# EAGLE design handheld temp sensor (EAGLE 7.2.0)
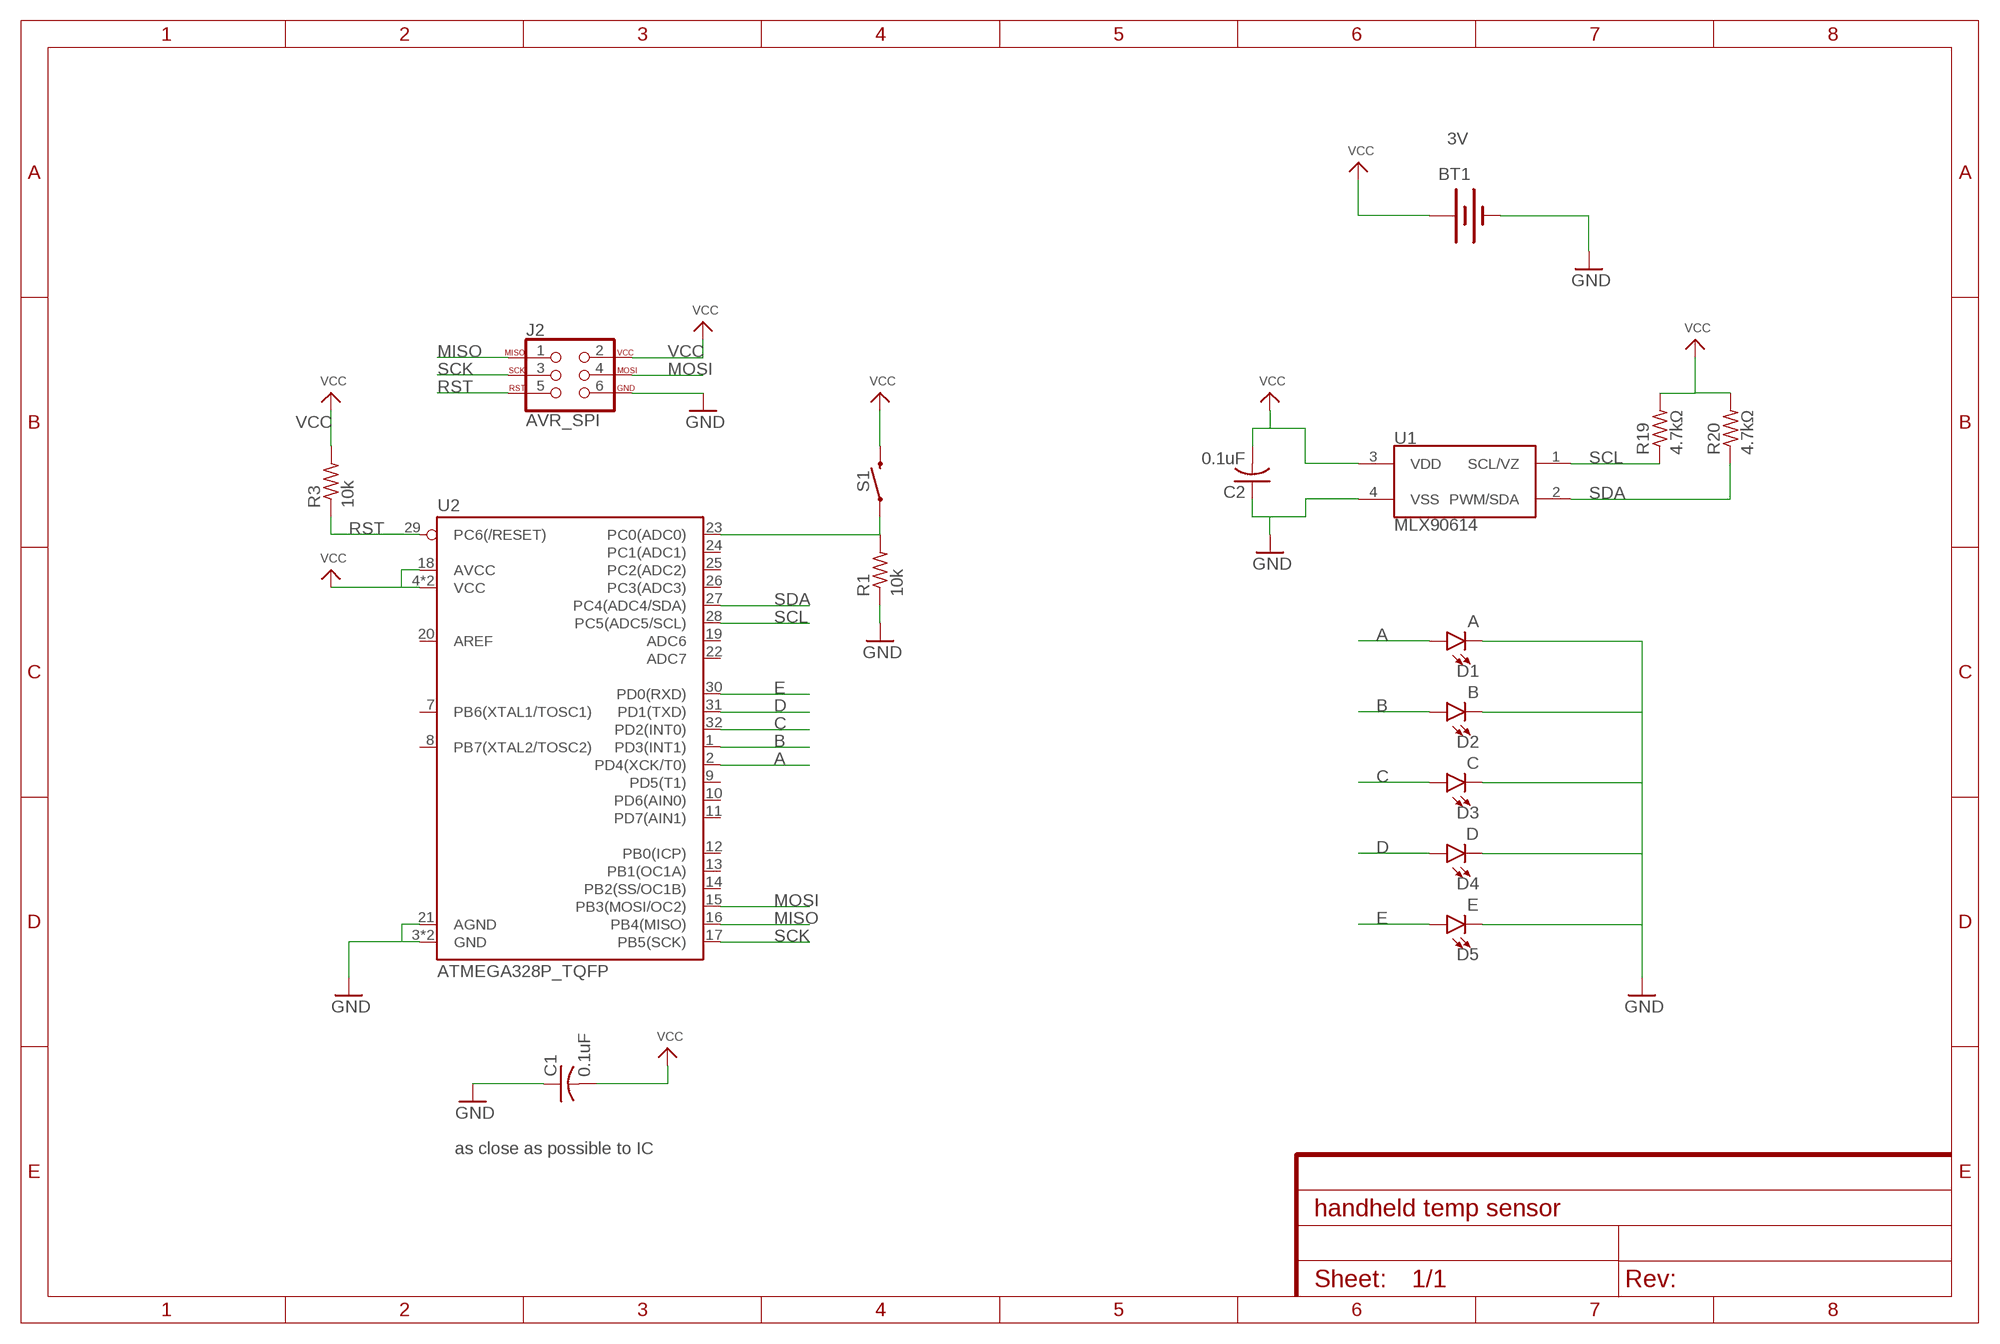
[diagram p0: schematic, sheet 1]

## Parts
BT1  BATTERYFOB  [BATTERY_20MM_PTH_COMPACT]
C1  0.1uF  C-USC1206  [C1206]
C2  0.1uF  C-USC1206  [C1206]
D1  A  LED-RED1206  [LED-1206]
D2  B  LED-RED1206  [LED-1206]
D3  C  LED-RED1206  [LED-1206]
D4  D  LED-RED1206  [LED-1206]
D5  E  LED-RED1206  [LED-1206]
J2  AVR_SPI  AVR_SPI_PROG_3X2SMD  [2X3_SMT_POSTS]
R1  10k  R-US_R1206  [R1206]
R3  10k  R-US_R1206  [R1206]
R19  4.7kΩ  R-US_R1206  [R1206]
R20  4.7kΩ  R-US_R1206  [R1206]
S1  MOMENTARY-SWITCH-SPST-PTH-6.0MM  [TACTILE_SWITCH_PTH_6.0MM]
U1  MLX90614  [TO-39]
U2  ATMEGA328P_TQFP  [TQFP32-08]

## Nets
A: D1.A U2.2(PD4(XCK/T0))
B: D2.A U2.1(PD3(INT1))
C: D3.A U2.32(PD2(INT0))
D: D4.A U2.31(PD1(TXD))
E: D5.A U2.30(PD0(RXD))
GND: BT1.2(-) C1.1 C2.1 D1.C D2.C D3.C D4.C D5.C J2.6 R1.1 U1.4(VSS) U2.3(GND) U2.5(GND) U2.21(AGND)
MISO: J2.1 U2.16(PB4(MISO))
MOSI: J2.4 U2.15(PB3(MOSI/OC2))
N$1: R1.2 S1.1 U2.23(PC0(ADC0))
RST: J2.5 R3.1 U2.29(PC6(/RESET))
SCK: J2.3 U2.17(PB5(SCK))
SCL: R19.1 U1.1(SCL/VZ) U2.28(PC5(ADC5/SCL))
SDA: R20.1 U1.2(PWM/SDA) U2.27(PC4(ADC4/SDA))
VCC: C1.2 J2.2 R3.2 U2.4(VCC) U2.6(VCC) U2.18(AVCC)
VMOTOR: BT1.1(+) C2.2 R19.2 R20.2 S1.3 U1.3(VDD) ; supply symbol labelled VCC
Unconnected: U2.7(PB6(XTAL1/TOSC1)) U2.8(PB7(XTAL2/TOSC2)) U2.9(PD5(T1)) U2.10(PD6(AIN0)) U2.11(PD7(AIN1)) U2.12(PB0(ICP)) U2.13(PB1(OC1A)) U2.14(PB2(SS/OC1B)) U2.19(ADC6) U2.20(AREF) U2.22(ADC7) U2.24(PC1(ADC1)) U2.25(PC2(ADC2)) U2.26(PC3(ADC3))

## Notes on the sheet
- 3V
- as close as possible to IC

## Library data of the parts
BT1 = SparkFun-Retired:BATTERY: Battery - Single Cell A variety of battery chemistries, sizes, and footprints. Including AA, AAA, 18650 (PRT-12895), 20mm coin cell and 12mm coin cell. 20MM_4LEGS, BATT-10373
C1 C2 = adafruit:C-US: CAPACITOR, American symbol
D1-D5 = SparkFun-LED:LED-RED: Red SMD LED Used in manufacturing of most products at SparkFun Packages: 0603 - SMD 0603 package [Product Link] <http://docs.avagotech.com/docs/AV02-0551EN> 0603 SMART - SMD 0603 SMART package ( more efficient and expensive)[Product Link] <http://www.osram-os.com/Graphics/XPic2/00077099_0.pdf> 1206 - SMD1206 package [Product Link] <https://www.sparkfun.com/datasheets/DevTools/LilyPad/Q150OVS4.pdff> SparkFun Products: Pro Mini 328 -5V <https://www.sparkfun.com/products/821> RedBoard <https://www.sparkfun.com/products/12757> IOIO-OTG <https://www.sparkfun.com/products/13613>; PROD_ID: DIO-09912; VALUE: RED
J2 = SparkFun-Connectors:AVR_SPI_PROG_3X2: AVR ISP 6 Pin This is the reduced ISP connector for AVR programming. Common on Arduino. This footprint will take up less PCB space and can be used with a 10-pin to 6-pin adapter such as SKU: BOB-08508 **Special note about "TEST_POINT" package. The stop mask is on the top side, so if you want your programming test points to be on the bottom of your board, make sure to place this package on the bottom side of the board. This also ensure that the orientation to program from the bottom side will be correct. SparkFun Products: SparkFun ISP Pogo Adapter <https://www.sparkfun.com/products/11591> - NS Tiny AVR Programmer <https://www.sparkfun.com/products/11801> -PTH
R1 R3 R19 R20 = adafruit:R-US_: RESISTOR, American symbol
S1 = SparkFun-Switches:MOMENTARY-SWITCH-SPST: Momentary Switch (Pushbutton) - SPST Normally-open (NO) SPST momentary switches (buttons, pushbuttons). Variants PTH-12MM - 12mm square, through-hole Momentary Pushbutton Switch - 12mm Square <https://www.sparkfun.com/products/9190> (COM-09190) PTH-6.0MM, PTH-6.0MM-KIT - 6.0mm square, through-hole Mini Pushbutton Switch <https://www.sparkfun.com/products/97> (COM-00097) KIT package intended for soldering kit's - only one side of pads' copper is exposed. PTH-RIGHT-ANGLE-KIT - Right-angle, through-hole Right Angle Tactile Button <https://www.sparkfun.com/products/10791> - Used on SparkFun BigTime Watch Kit <https://www.sparkfun.com/products/11734> SMD-12MM - 12mm square, surface-mount Tactile Button - SMD (12mm) <https://www.sparkfun.com/products/12993> (COM-12993) Used on SparkFun PicoBoard <https://www.sparkfun.com/products/11888> SMD-4.5MM - 4.5mm Square Trackball Switch Used on SparkFun Blackberry Trackballer Breakout <https://www.sparkfun.com/products/13169> SMD-4.6MMX2.8MM - 4.60mm x 2.80mm, surface mount Used on SparkFun SAMD21 Mini Breakout <https://www.sparkfun.com/products/13664> SMD-5.2MM, SMD-5.2-REDUNDANT - 5.2mm square, surface-mount Mini Pushbutton Switch - SMD <https://www.sparkfun.com/products/8720> (COM-08720) Used on Arduino Pro Mini <https://www.sparkfun.com/products/11114> REDUNDANT package connects both switch circuits together SMD-6.0X3.5MM - 6.0 x 3.5mm, surface mount Momentary Reset Switch SMD <https://www.sparkfun.com/products/8229> (COM-08229) SMD-6.2MM-TALL - 6.2mm square, surface mount Tactile Button - SMD (6mm) <https://www.sparkfun.com/products/12992> Used on SparkFun Digital Sandbox <https://www.sparkfun.com/products/12651> SMD-RIGHT-ANGLE - Right-angle, surface mount Used on SparkFun Block for Intel® Edison - Arduino <https://www.sparkfun.com/products/13036>; PROD_ID: SWCH-08441; SF_SKU: COM-00097
U1 = SparkFun-Sensors:MLX90614: Melexis MLX90614 Infrared (IR) Thermometer The MLX90614 is a passive infrared (PIR) I2C temperature sensor.It is designed for non-contact temperature sensing. An internal 17-bit ADC and a powerful DSP contribute to the MLX90614’s high accuracy and resolution. It has a huge number of applications including body temperature measurment and movement detection. Datasheet <http://www.sparkfun.com/datasheets/Sensors/Temperature/SEN-09570-datasheet-3901090614M005.pdf> SparkFun Products Infrared Thermometer - MLX90614 <https://www.sparkfun.com/products/9570> (SEN-09570) SparkFun IR Thermometer Evaluation Board - MLX90614 <https://www.sparkfun.com/products/10740> (SEN-10740); PROD_ID: COMP-09719; SF_ID: SEN-09570
U2 = SparkFun-IC-Microcontroller:ATMEGA328P_TQFP: Popular 328P in QFP Storefront component: ATmega328 - TQFP <https://www.sparkfun.com/products/13448> (COM-13448) Datasheet <http://www.sparkfun.com/datasheets/Components/SMD/ATMega328.pdf> SparkFun Products SparkFun RedBoard - Programmed with Arduino <https://www.sparkfun.com/products/12757> (DEV-12757) Arduino Pro Mini 328 - 5V/16MHz <https://www.sparkfun.com/products/11113> (DEV-11113) Arduino Pro Mini 328 - 3.3V/8MHz <https://www.sparkfun.com/products/11114> (DEV-11114) SparkFun OpenLog <https://www.sparkfun.com/products/13712> (DEV-13712) SparkFun MicroView - OLED Arduino Module <https://www.sparkfun.com/products/12923> (DEV-12923) SparkFun Digital Sandbox <https://www.sparkfun.com/products/12651> (DEV-12651) SparkFun PicoBoard <https://www.sparkfun.com/products/11888> (WIG-11888) Arduino Fio <https://www.sparkfun.com/products/10116> (DEV-10116) LilyPad Arduino 328 Main Board <https://www.sparkfun.com/products/13342> (DEV-13342) SparkFun RedStick <https://www.sparkfun.com/products/13741> (DEV-13741) LilyPad MP3 <https://www.sparkfun.com/products/11013> (DEV-11013) LilyPad Arduino SimpleSnap <https://www.sparkfun.com/products/10941> (DEV-10941) SparkFun Stepoko <https://www.sparkfun.com/products/13899> (ROB-13899) SparkFun Geiger Counter <https://www.sparkfun.com/products/11345> (SEN-11345) SparkFun EL Sequencer <https://www.sparkfun.com/products/12781> (COM-12781) Arduino Pro 328 - 5V/16MHz <https://www.sparkfun.com/products/10915> (DEV-10915) CryptoCape <https://www.sparkfun.com/products/12773> (DEV-12773) SparkFun IR Thermometer Evaluation Board - MLX90614 <https://www.sparkfun.com/products/10740> (SEN-10740) SparkFun RedBot Mainboard <https://www.sparkfun.com/products/12097> (ROB-12097) Arduino Pro 328 - 3.3V/8MHz <https://www.sparkfun.com/products/10914> (DEV-10914) SparkFun Block for Intel® Edison - Arduino <https://www.sparkfun.com/products/13036> (DEV-13036) SparkFun Simon Says - Surface Mount Soldering Kit <https://www.sparkfun.com/products/10935> (KIT-10935) SparkFun 7-Segment Serial Display - Red <https://www.sparkfun.com/products/11441> (COM-11441) SparkFun 7-Segment Serial Display - White <https://www.sparkfun.com/products/11629> (COM-11629) SparkFun 7-Segment Serial Display - Yellow <https://www.sparkfun.com/products/11443> (COM-11443) SparkFun 7-Segment Serial Display - Kelly Green <https://www.sparkfun.com/products/11440> (COM-11440) SparkFun 7-Segment Serial Display - Blue <https://www.sparkfun.com/products/11442> (COM-11442) SparkFun OpenSegment Serial Display - 20mm (Blue) <https://www.sparkfun.com/products/11647> (COM-11647) SparkFun OpenSegment Serial Display - 20mm (Green) <https://www.sparkfun.com/products/11646> (COM-11646) SparkFun OpenSegment Serial Display - 20mm (White) <https://www.sparkfun.com/products/11648> (COM-11648) SparkFun OpenSegment Serial Display - 20mm (Red) <https://www.sparkfun.com/products/11644> (COM-11644) SparkFun OpenSegment Serial Display - 20mm (Yellow) <https://www.sparkfun.com/products/11645> (COM-11645) SparkFun OpenSegment Shield <https://www.sparkfun.com/products/13190> (DEV-13190); PROD_ID: IC-09069

## Board
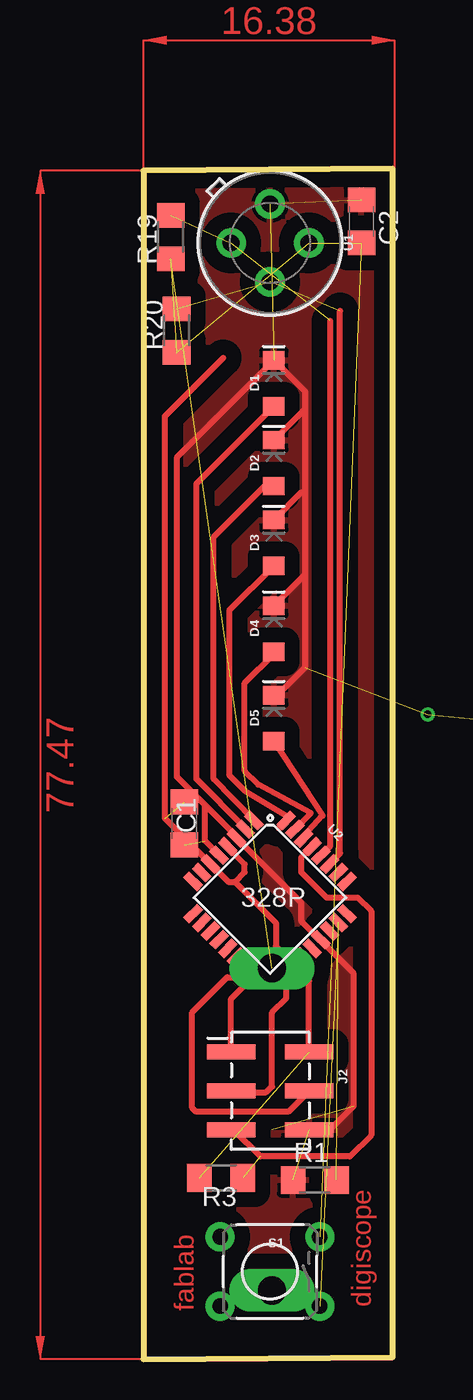
[diagram p1: board, top side]
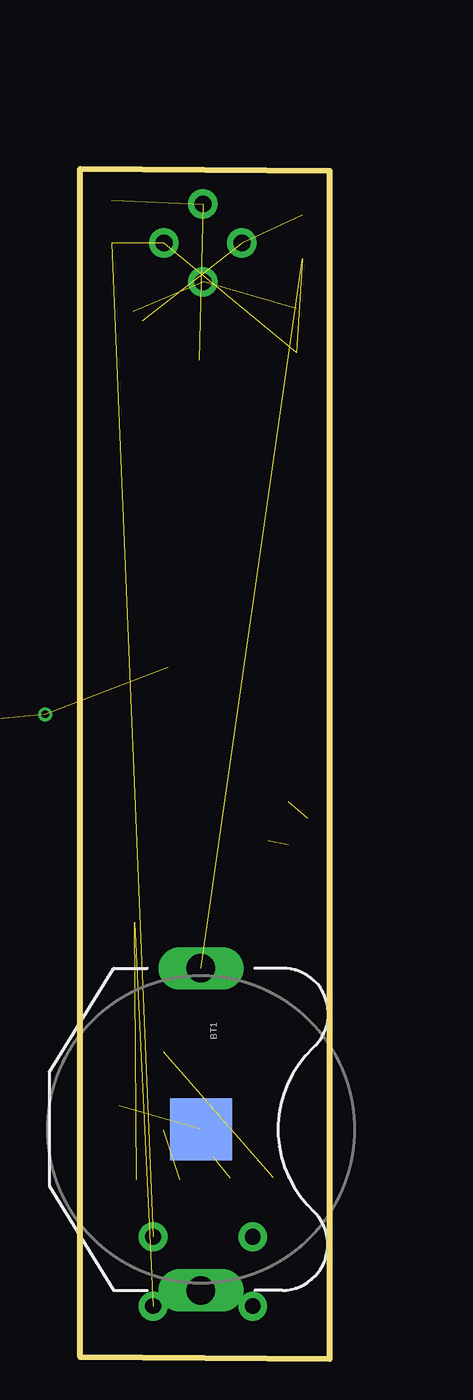
[diagram p2: board, bottom side, seen from below]

Size 16.26 x 77.6 mm. Coordinates in mm from the lower left corner, seen from the top.
Outline: 0,0 16.26,0.13 16.26,77.6 0,77.47 0,0
Copper layers (1*16): Top 0.035mm / dielectric 1.5mm / Bottom 0.035mm
Design rules "adafruit *": minimum track width 1mm, minimum drill 1mm, track to track 1mm, track to pad 1mm, pad to pad 1mm, via to via 1mm, smd to smd 1mm, copper to edge 1mm, drill to drill 1mm, minimum pad ring 10mil, minimum via ring 8mil, stop-mask expansion 2mil, vias tented up to drill 20mil, thermal gap 10mil

### Footprints (pad centres in the part's own frame; a part is rotated, then mirrored left to right if it is on the bottom)
BATTERY_20MM_PTH_COMPACT = drill 1.854 long: 1 -10.5,0; 3 10.5,0 | smd 4.064 x 4.064: 2 0,0
C1206 = smd 1.6 x 1.8: 1 -1.4,0; 2 1.4,0
LED-1206 = smd 1.2 x 1.4: A -1.5,0; C 1.5,0
2X3_SMT_POSTS = smd 1 x 3.17: 1 -2.54,-2.54; 2 -2.54,2.54; 3 0,-2.54; 4 0,2.54; 5 2.54,-2.54; 6 2.54,2.54
R1206 = smd 1.6 x 1.803: 1 -1.422,0; 2 1.422,0
TACTILE_SWITCH_PTH_6.0MM = drill 1.016 pad 1.88: 1 -3.251,2.261; 2 3.251,2.261; 3 -3.251,-2.261; 4 3.251,-2.261
TO-39 = drill 1.1 pad 1.93: 1 2.54,0; 2 0,2.54; 3 -2.54,0; 4 0,-2.54
TQFP32-08 = smd 1.27 x 0.559: 1 -4.293,2.8; 2 -4.293,2; 3 -4.293,1.2; 4 -4.293,0.4; 5 -4.293,-0.4; 6 -4.293,-1.2; 7 -4.293,-2; 8 -4.293,-2.8; 17 4.293,-2.8; 18 4.293,-2; 19 4.293,-1.2; 20 4.293,-0.4; 21 4.293,0.4; 22 4.293,1.2; 23 4.293,2; 24 4.293,2.8 | smd 0.559 x 1.27: 9 -2.8,-4.293; 10 -2,-4.293; 11 -1.2,-4.293; 12 -0.4,-4.293; 13 0.4,-4.293; 14 1.2,-4.293; 15 2,-4.293; 16 2.8,-4.293; 25 2.8,4.293; 26 2,4.293; 27 1.2,4.293; 28 0.4,4.293; 29 -0.4,4.293; 30 -1.2,4.293; 31 -2,4.293; 32 -2.8,4.293

### Placement (x,y rotation side)
BT1  8.38,14.99 270 bottom
C1  2.67,34.92 90 top
C2  14.22,74.17 270 top
D1  8.51,63.63 90 top
D2  8.51,58.42 90 top
D3  8.51,53.21 90 top
D4  8.51,47.62 90 top
D5  8.51,41.78 90 top
J2  8.27,17.49 270 top
R1  11.18,11.68 0 top
R3  5.06,11.83 180 top
R19  1.78,73.15 270 top
R20  2.16,67.06 270 top
S1  8.25,5.71 180 top
U1  8.25,72.77 180 top
U2  8.25,30.1 315 top

### Tracks (layer width: path | path; a pad name or v marks a point on that pad's centre or on a via)
A
  Top 0.406: D1.A 3.43,57.05 3.43,37.85 6.63,34.64 U2.2
B
  Top 0.406: U2.1 4.57,37.82 4.57,53.59 7.9,56.92 D2.A
C
  Top 0.406: D3.A 5.59,48.79 5.59,38.1 6.6,37.08 9.52,35.31 8.82,34.61 U2.32
D
  Top 0.406: U2.31 10.92,35.59 7.49,37.46 6.6,38.35 6.6,44.07 8.51,45.97 D4.A
E
  Top 0.406: D5.A 11.68,35.43 10.44,34.06 U2.30
GND  (via drill 0.5)  (10 unrouted)
  Top 0.406: 10.54,61.95 10.54,63.09 D1.C 2.16,58.78 2.16,37.97 4,36.13 | 10.54,61.95 10.54,56.52 | 10.54,56.52 10.54,51.16 | 10.54,51.16 10.54,45.09 8.74,43.28 D5.C | D4.C 10.54,51.16 | D3.C 10.31,56.52 10.54,56.52 | D2.C 10.54,61.95 | 4,36.13 6.07,34.06 U2.3 10.29,29.76 10.29,28.58 11.52,27.35 U2.21 11.57,27.29 13.72,25.15 13.72,16.51 12.19,14.99 10.85,14.99 J2.6 | U2.5 4,33.79 4,36.13
  other vias: 52.26,38.8 63.12,13.72 65.15,10.16 18.54,42.04 65.15,13.72
  pour Top: 0.63,77.34 15.75,77.47 15.75,0.89 0.63,0.76
MISO
  Top 0.406: J2.1 5.71,20.04 5.71,23.5 7.2,24.98 U2.16
MOSI
  Top 0.406: J2.4 9.45,16.13 3.43,16.13 3.17,16.38 3.17,22.61 5.46,24.89 5.84,24.89 6.6,25.65 U2.15
N$1  (2 unrouted)
RST  (1 unrouted)
  Top 0.406: U2.29 10.29,32.7 10.29,31.75 11.94,30.1 13.97,30.1 14.86,29.21 14.86,14.6 13.46,13.21 7.62,13.21 5.88,14.95 J2.5
SCK
  Top 0.406: J2.3 5.82,17.4 8,17.4 8.38,17.78 8.38,22.61 9.31,23.53 U2.17
SCL  (2 unrouted)
  Top 0.406: U2.28 12.19,33.47 12.19,67.69
SDA  (2 unrouted)
  Top 0.406: U2.27 12.83,32.97 12.83,68.33
VCC  (2 unrouted)
  Top 0.406: 5.21,65.28 1.4,61.47 1.4,35.26 U2.6 5.54,31.12 5.97,31.12 | 5.97,31.12 6.6,31.75 6.6,32.26 5.5,33.36 U2.4 | 5.97,31.12 8.64,28.45 8.64,26.92 9.88,25.68 U2.18 9.88,25.56 10.79,24.64 10.79,20.04 J2.2
VMOTOR  (5 unrouted)
(copper drawn outside any net)
  shapes: Top area x2

### Text on the board
Top: digiscope | fablab
tPlace: 328P